# EAGLE design Controller (EAGLE 9.6.2)
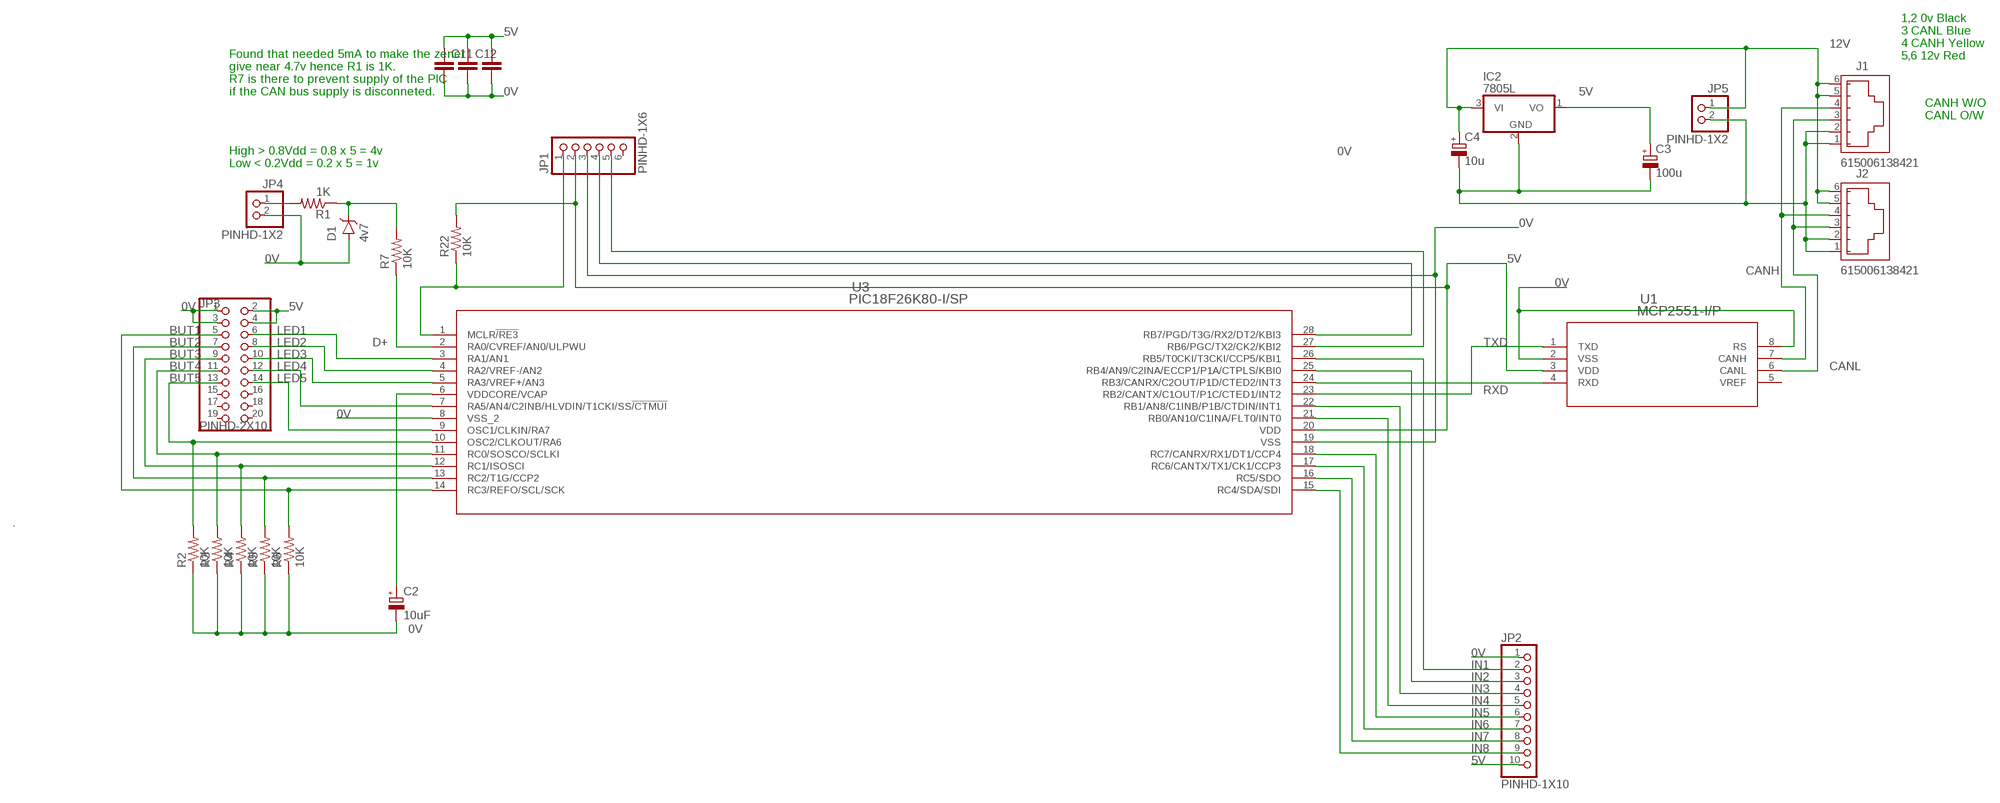
[diagram p0: schematic, sheet 1]

## Parts
C2  10uF  CPOL-EUE3.5-8  [E3,5-8]
C3  100u  CPOL-EUE3.5-8  [E3,5-8]
C4  10u  CPOL-EUE3.5-8  [E3,5-8]
C7  C2,5-3  [C2.5-3]
C11  C2,5-3  [C2.5-3]
C12  C2,5-3  [C2.5-3]
D1  4v7  BZX55B15-TAP  [DO-35]
IC2  7805L  [TO92]
J1  615006138421  [615006138421]
J2  615006138421  [615006138421]
JP1  PINHD-1X6  [1X06]
JP2  PINHD-1X10  [1X10]
JP3  PINHD-2X10  [2X10]
JP4  PINHD-1X2  [1X02]
JP5  PINHD-1X2  [1X02]
R1  1K  RES_7  [0204/7]
R2  10K  RES_7  [0204/7]
R3  10K  RES_7  [0204/7]
R4  10K  RES_7  [0204/7]
R5  10K  RES_7  [0204/7]
R6  10K  RES_7  [0204/7]
R7  10K  RES_7  [0204/7]
R22  10K  RES_7  [0204/7]
U1  MCP2551-I/P  [PDIP8_300MC_MCH]
U3  PIC18F26K80-I/SP  [SPDIP28_300MC_MCH]

## Nets
0V: C2.- C3.- C4.- C7.2 C11.2 C12.2 D1.A IC2.2(GND) J1.1 J1.2 J2.1 J2.2 JP1.3 JP2.1 JP3.1 JP3.3 JP4.2 JP5.2 R2.1 R3.1 R4.1 R5.1 R6.1 U1.2(VSS) U1.8(RS) U3.8(VSS_2) U3.19(VSS)
5V: C3.+ C7.1 C11.1 C12.1 IC2.1(VO) JP1.2 JP2.10 JP3.2 JP3.4 R22.2 U1.3(VDD) U3.20(VDD)
12V: C4.+ IC2.3(VI) J1.5 J1.6 J2.5 J2.6 JP5.1
BUT1: JP3.5 R6.2 U3.14(RC3/REFO/SCL/SCK)
BUT2: JP3.7 R5.2 U3.13(RC2/T1G/CCP2)
BUT3: JP3.9 R4.2 U3.12(RC1/ISOSCI)
BUT4: JP3.11 R3.2 U3.11(RC0/SOSCO/SCLKI)
BUT5: JP3.13 R2.2 U3.10(OSC2/CLKOUT/RA6)
CANH: J1.4 J2.4 U1.7(CANH)
CANL: J1.3 J2.3 U1.6(CANL)
D+: R7.1 U3.2(RA0/CVREF/AN0/ULPWU)
IN1: JP2.2 U3.26(RB5/T0CKI/T3CKI/CCP5/KBI1)
IN2: JP2.3 U3.25(RB4/AN9/C2INA/ECCP1/P1A/CTPLS/KBI0)
IN3: JP2.4 U3.22(RB1/AN8/C1INB/P1B/CTDIN/INT1)
IN4: JP2.5 U3.21(RB0/AN10/C1INA/FLT0/INT0)
IN5: JP2.6 U3.18(RC7/CANRX/RX1/DT1/CCP4)
IN6: JP2.7 U3.17(RC6/CANTX/TX1/CK1/CCP3)
IN7: JP2.8 U3.16(RC5/SDO)
IN8: JP2.9 U3.15(RC4/SDA/SDI)
LED1: JP3.6 U3.3(RA1/AN1)
LED2: JP3.8 U3.4(RA2/VREF-/AN2)
LED3: JP3.10 U3.5(RA3/VREF+/AN3)
LED4: JP3.12 U3.7(RA5/AN4/C2INB/HLVDIN/T1CKI/SS!/CTMUI)
LED5: JP3.14 U3.9(OSC1/CLKIN/RA7)
N$1: D1.C R1.1 R7.2
N$5: JP1.1 R22.1 U3.1(MCLR!/RE3)
N$8: JP1.4 U3.28(RB7/PGD/T3G/RX2/DT2/KBI3)
N$9: JP1.5 U3.27(RB6/PGC/TX2/CK2/KBI2)
N$14: C2.+ U3.6(VDDCORE/VCAP)
N$25: JP4.1 R1.2
RXD: U1.4(RXD) U3.24(RB3/CANRX/C2OUT/P1D/CTED2/INT3)
TXD: U1.1(TXD) U3.23(RB2/CANTX/C1OUT/P1C/CTED1/INT2)
Unconnected: JP1.6 JP3.15 JP3.16 JP3.17 JP3.18 JP3.19 JP3.20 U1.5(VREF)

## Notes on the sheet
- 1,2 0v Black
  3 CANL Blue
  4 CANH Yellow
  5,6 12v Red
- Found that needed 5mA to make the zener
  give near 4.7v hence R1 is 1K.
  R7 is there to prevent supply of the PIC
  if the CAN bus supply is disconneted.
- CANH W/O
  CANL O/W
- High > 0.8Vdd = 0.8 x 5 = 4v
  Low < 0.2Vdd = 0.2 x 5 = 1v

## Library data of the parts
C2-C4 = andrew-boyson:CPOL-EU: POLARIZED CAPACITOR, European symbol; SPICEPREFIX: C
C7 C11 C12 = capacitor-wima:C: CAPACITOR naming: grid - package width
D1 = Diodes-2:BZX55B15-TAP: DIODE ZENER 15V 500MW DO35 Manufacturer's datasheet <https://www.vishay.com/docs/85604/bzx55.pdf>; CREATED_BY: PCBLayout.com; DIGIKEY_PARTNO: BZX55B15-TAPGICT-ND; MANUFACTURER: Vishay General Semiconductor - Diodes Division; MPN: BZX55B15-TAP; PACKAGE: DO-35
IC2 = adafruit:78*: Positive VOLTAGE REGULATOR Added bigger pads to the TO-92 package
J1 J2 = Wurth_Connectors_WR-MJ:615006138421: WR-MJ Modular Jack Horizontal Plastic 6PxC Tab Up KIND PROPERTIES Quality Class:500 Mating cycles General Information Operating Temperature:-40 up to +85 °C Compliance: RoHS Electrical Properties IR 1:1.5A Working Voltage:120V (AC) Withstanding Voltage:1000V (AC) Contact Resistance:20mΩ RISO:500 MΩ Material Properties Insulator MateriaL:PBT Insulator Flammability Rating:UL94 V-0 Color:Black Contact Material Copper Alloy Contact Plating:Gold Contact Type:Stamped Packaging Properties Packaging:Tray <https://www.we-online.com/catalog/media/o33138v209%20Family_WR-MJ_61500x138421.jpg> Details see: https://www.we-online.com/catalog/en/MJ_HORIZONTAL_PLASTIC_6PXC_TAB_UP/? Updated by Yingchun,Shan 2020-01-06 2020 (C) Würth Elektronik; DATASHEET-URL: https://www.we-online.com/catalog/datasheet/615006138421.pdf; MOUNT: THT; PART-NUMBER: 615006138421; TYPE: Horizontal; XPXC: 6P6C
JP1 = Connector:PINHD-1X6: PIN HEADER; CATEGORY: CONNECTOR; SUB-CATEGORY: PIN-HEADER
JP2 = Connector:PINHD-1X10: PIN HEADER; CATEGORY: CONNECTOR; SUB-CATEGORY: PIN-HEADER
JP3 = Connector:PINHD-2X10: PIN HEADER; CATEGORY: CONNECTOR; SUB-CATEGORY: PIN-HEADER
JP4 JP5 = Connector:PINHD-1X2: PIN HEADER; CATEGORY: CONNECTOR; SUB-CATEGORY: PIN-HEADER
R1-R7 R22 = andrew-boyson:RES_7: RESISTOR, American symbol
U1 = andrew-boyson:MCP2551-I/P; COPYRIGHT: Copyright (C) 2021 Ultra Librarian. All rights reserved.; MANUFACTURER_PART_NUMBER: MCP2551-I/P; MFR_NAME: Microchip
U3 = andrew-boyson:PIC18F26K80-I/SP; COPYRIGHT: Copyright (C) 2021 Ultra Librarian. All rights reserved.; MANUFACTURER_PART_NUMBER: pic18f26k80-i/sp; MFR_NAME: Microchip

## Board
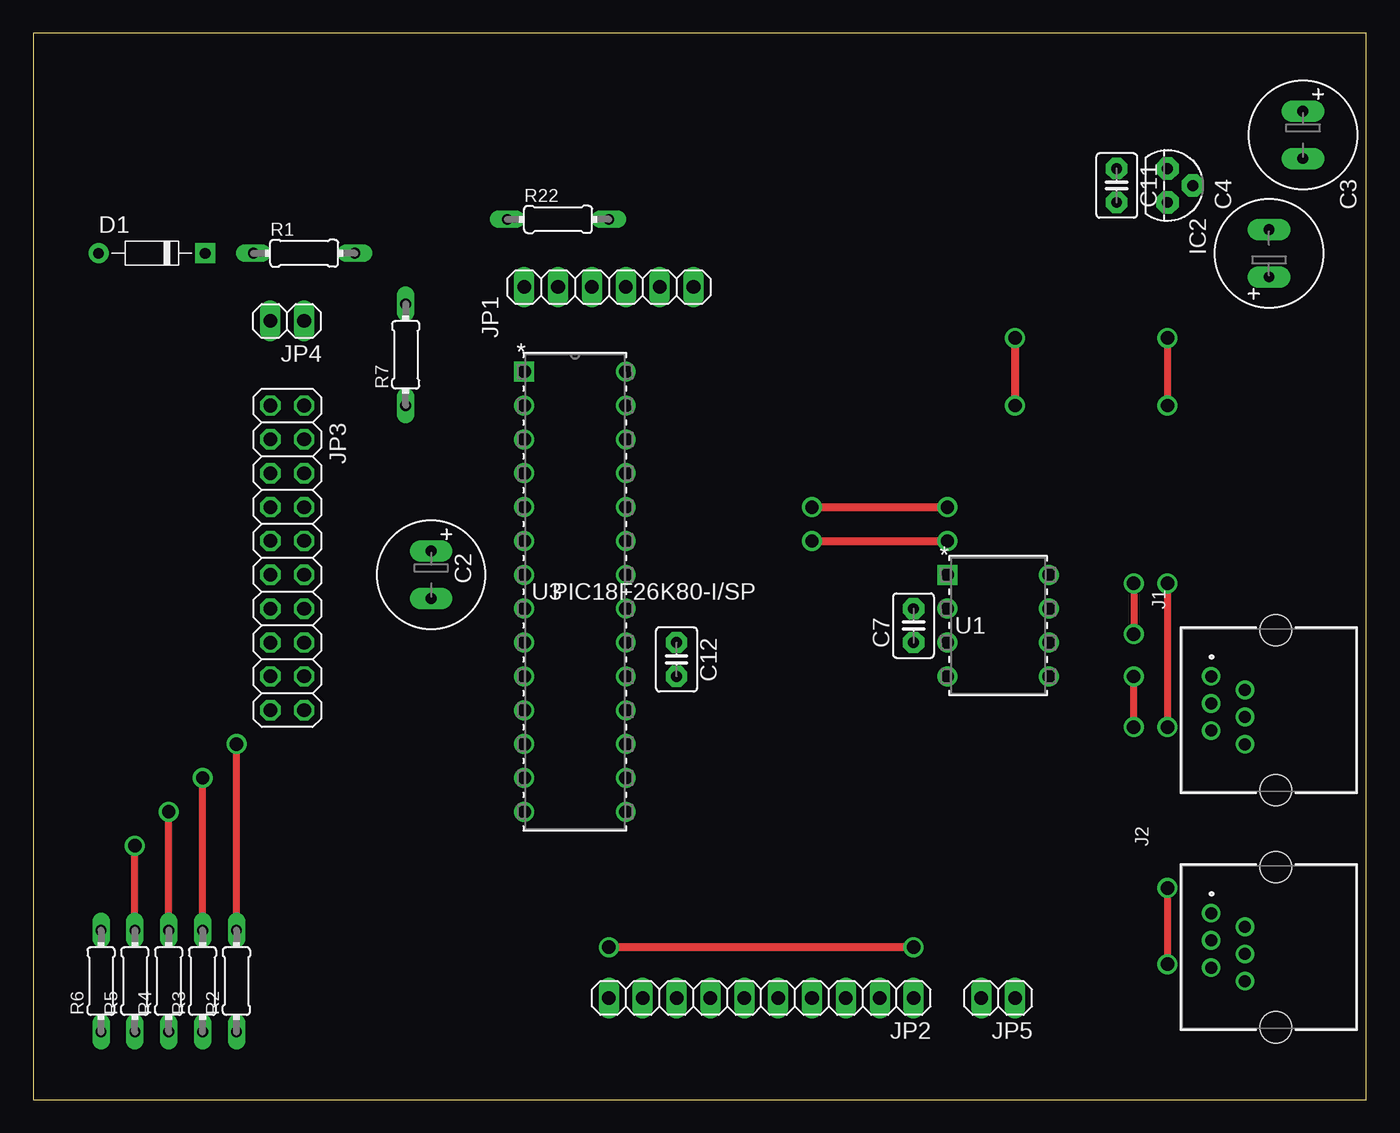
[diagram p1: board, top side]
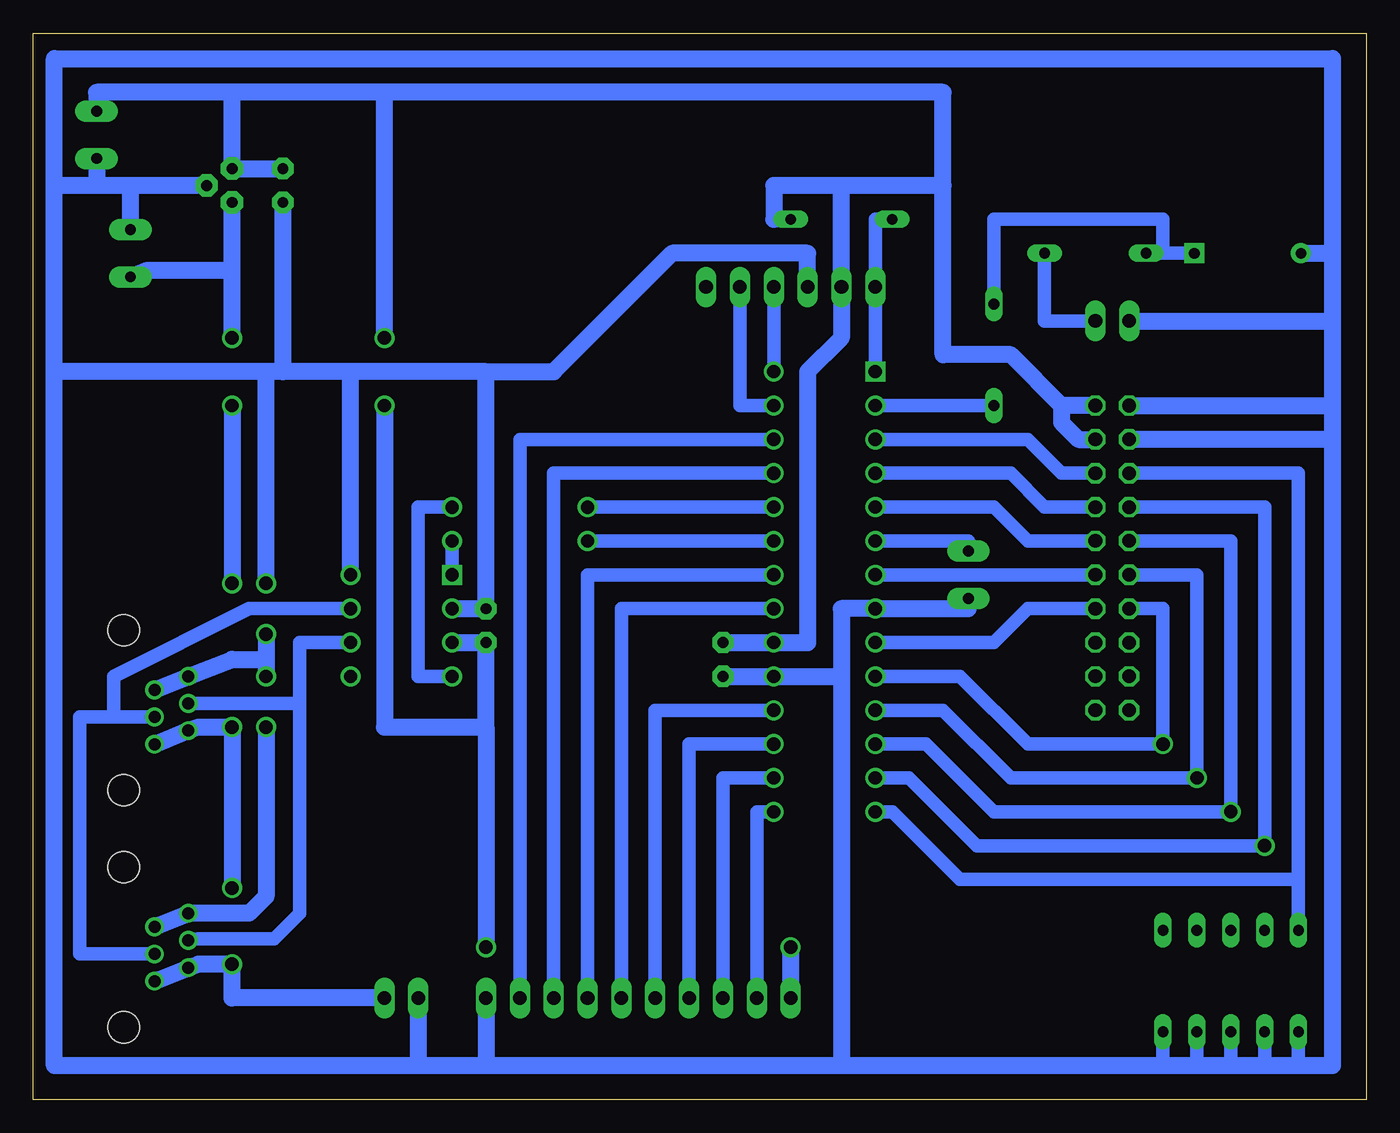
[diagram p2: board, bottom side, seen from below]

Size 100 x 80 mm. Coordinates in mm from the lower left corner, seen from the top.
Outline: 0,0 100,0 100,80 0,80 0,0
Copper layers (1*16): Top 0.035mm / dielectric 1.5mm / Bottom 0.035mm
Design rules "default": minimum track width 6mil, minimum drill 0.35mm, track to track 6mil, track to pad 6mil, pad to pad 6mil, via to via 6mil, smd to smd 6mil, copper to edge 40mil, drill to drill 6mil, minimum pad ring 10mil, minimum via ring 8mil, stop-mask expansion 4mil, vias tented up to drill 0mil, thermal gap 10mil

### Footprints (pad centres in the part's own frame; a part is rotated, then mirrored left to right if it is on the bottom)
E3,5-8 = drill 0.813 pad 1.6 long: + -1.778,0; - 1.778,0
C2.5-3 = drill 0.813 pad 1.6 octagon: 1 -1.27,0; 2 1.27,0
DO-35 = drill 0.8 pad 1.5: A -4,0 | drill 0.8 pad 1.5 square: C 4,0
TO92 = drill 0.813 pad 1.676 octagon: 1 -1.27,0; 2 0,1.905; 3 1.27,0
615006138421 = drill 0.9: 1 2.55,4.34; 2 1.53,1.8; 3 0.51,4.34; 4 -0.51,1.8; 5 -1.53,4.34; 6 -2.55,1.8 | hole 2.36: -6,-0.5; 6,-0.5
1X06 = drill 1.016 long: 1 -6.35,0; 2 -3.81,0; 3 -1.27,0; 4 1.27,0; 5 3.81,0; 6 6.35,0
1X10 = drill 1.016 long: 1 -11.43,0; 2 -8.89,0; 3 -6.35,0; 4 -3.81,0; 5 -1.27,0; 6 1.27,0; 7 3.81,0; 8 6.35,0; 9 8.89,0; 10 11.43,0
2X10 = drill 1.016 octagon: 1 -11.43,-1.27; 2 -11.43,1.27; 3 -8.89,-1.27; 4 -8.89,1.27; 5 -6.35,-1.27; 6 -6.35,1.27; 7 -3.81,-1.27; 8 -3.81,1.27; 9 -1.27,-1.27; 10 -1.27,1.27; 11 1.27,-1.27; 12 1.27,1.27; 13 3.81,-1.27; 14 3.81,1.27; 15 6.35,-1.27; 16 6.35,1.27; 17 8.89,-1.27; 18 8.89,1.27; 19 11.43,-1.27; 20 11.43,1.27
1X02 = drill 1.016 long: 1 -1.27,0; 2 1.27,0
0204/7 = drill 0.813 long: 1 -3.81,0; 2 3.81,0
PDIP8_300MC_MCH = drill 0.991 pad 1.499 square: 1 0,0 | drill 0.991 pad 1.499: 2 0,-2.54; 3 0,-5.08; 4 0,-7.62; 5 7.62,-7.62; 6 7.62,-5.08; 7 7.62,-2.54; 8 7.62,0
SPDIP28_300MC_MCH = drill 0.991 pad 1.499 square: 1 0,0 | drill 0.991 pad 1.499: 2 0,-2.54; 3 0,-5.08; 4 0,-7.62; 5 0,-10.16; 6 0,-12.7; 7 0,-15.24; 8 0,-17.78; 9 0,-20.32; 10 0,-22.86; 11 0,-25.4; 12 0,-27.94; 13 0,-30.48; 14 0,-33.02; 15 7.62,-33.02; 16 7.62,-30.48; 17 7.62,-27.94; 18 7.62,-25.4; 19 7.62,-22.86; 20 7.62,-20.32; 21 7.62,-17.78; 22 7.62,-15.24; 23 7.62,-12.7; 24 7.62,-10.16; 25 7.62,-7.62; 26 7.62,-5.08; 27 7.62,-2.54; 28 7.62,0

### Placement (x,y rotation side)
C2  29.84,39.37 270 top
C3  95.25,72.39 270 top
C4  92.71,63.5 90 top
C7  66.04,35.56 90 top
C11  81.28,68.58 270 top
C12  48.26,33.02 270 top
D1  8.89,63.5 0 top
IC2  85.09,68.58 270 top
J1  92.71,29.21 90 top
J2  92.71,11.43 90 top
JP1  43.18,60.96 0 top
JP2  54.61,7.62 180 top
JP3  19.05,40.64 270 top
JP4  19.05,58.42 180 top
JP5  72.39,7.62 180 top
R1  20.32,63.5 0 top
R2  15.24,8.89 90 top
R3  12.7,8.89 90 top
R4  10.16,8.89 90 top
R5  7.62,8.89 90 top
R6  5.08,8.89 90 top
R7  27.94,55.88 90 top
R22  39.37,66.04 0 top
U1  68.58,39.37 0 top
U3  36.83,54.61 0 top

### Tracks (layer width: path | path; a pad name or v marks a point on that pad's centre or on a via)
0V  (via drill 1)
  Top 0.508: v82.55,27.94 v82.55,31.75 | v82.55,38.73 v82.55,34.92
  Bottom 1.016: 71.12,2.61 70.91,2.54 | R6.1 5.08,2.54 | R2.1 15.24,2.54 | R3.1 12.7,2.54 | R4.1 10.16,2.54 | R5.1 7.62,2.54
  Bottom 1.27: 39.37,31.75 U3.19 C12.2 | JP1.3 41.91,63.5 52.07,63.5 60.96,54.61 66.04,54.61 | U1.2 C7.2 66.04,54.61 | 39.37,31.75 39.37,2.54 | C2.- 29.84,36.83 U3.8 39.37,36.83 39.37,31.75 | 39.37,2.54 66.04,2.54 | 66.04,2.54 70.91,2.54 98.42,2.54 98.42,54.61 | J1.2 J1.1 85.09,33.02 82.55,33.02 | J2.2 J2.1 83.82,13.97 82.55,15.24 v82.55,27.94 | 66.04,54.61 76.2,54.61 | 76.2,54.61 81.28,54.61 | 82.55,54.61 98.42,54.61 | 98.42,54.61 98.42,68.58 | IC2.2 92.71,68.58 | 92.71,68.58 95.25,68.58 | 95.25,68.58 98.42,68.58 | C11.2 81.28,54.61 | 81.28,54.61 82.55,54.61 | v82.55,38.73 82.55,54.61 | v82.55,34.92 82.55,33.02 | 82.55,33.02 v82.55,31.75 | C3.- 95.25,68.58 | C4.- 92.71,68.58 | JP3.1 2.54,52.07 | 2.54,52.07 2.54,49.53 | 2.54,49.53 2.54,2.54 5.08,2.54 7.62,2.54 10.16,2.54 12.7,2.54 15.24,2.54 39.37,2.54 | U1.8 76.2,54.61 | JP4.2 2.54,58.42 | 2.54,58.42 2.54,52.07 | D1.A 2.54,63.5 | 2.54,63.5 2.54,58.42 | JP5.2 71.12,2.61 | 98.42,68.58 98.42,78.11 2.54,78.11 2.54,63.5 | 2.54,49.53 JP3.3 | JP2.1 66.04,2.54
5V  (via drill 1)
  Top 0.61: v73.66,57.15 v73.66,52.07 | v66.04,11.43 v43.18,11.43
  Bottom 1.27: U1.3 C7.1 66.04,27.94 | C12.1 U3.20 41.91,34.29 41.91,54.61 39.37,57.15 JP1.2 39.37,68.58 | 31.75,68.58 39.37,68.58 | 39.37,68.58 44.45,68.58 44.45,66.04 R22.2 | 31.75,68.58 31.75,75.56 73.66,75.56 | 73.66,75.56 85.09,75.56 | 85.09,75.56 95.25,75.56 C3.+ | 85.09,75.56 IC2.1 C11.1 | JP3.2 22.86,52.07 | 22.86,52.07 26.67,55.88 31.75,55.88 31.75,68.58 | v73.66,57.15 73.66,75.56 | 66.04,27.94 v66.04,11.43 | 66.04,27.94 73.66,27.94 v73.66,52.07 | 22.86,52.07 22.86,50.8 21.59,49.53 JP3.4 | v43.18,11.43 JP2.10
12V  (via drill 1)
  Top 0.508: v85.09,57.15 v85.09,52.07 | v85.09,38.73 v85.09,27.94 | v85.09,15.88 v85.09,10.16
  Bottom 1.27: J2.6 J2.5 87.63,10.16 v85.09,10.16 85.09,7.62 JP5.1 | J1.6 J1.5 87.63,27.94 v85.09,27.94 v85.09,15.88 | v85.09,57.15 85.09,62.23 | 85.09,62.23 IC2.3 | C4.+ 91.44,62.23 85.09,62.23 | v85.09,52.07 v85.09,38.73
BUT1
  Bottom 1.016: U3.14 35.56,21.59 30.48,16.51 5.08,16.51 | 5.08,16.51 5.08,46.99 JP3.5 | R6.2 5.08,16.51
BUT2  (via drill 1)
  Top 0.508: R5.2 v7.62,19.05
  Bottom 1.016: U3.13 34.29,24.13 29.21,19.05 v7.62,19.05 7.62,44.45 JP3.7
BUT3  (via drill 1)
  Top 0.508: R4.2 v10.16,21.59
  Bottom 1.016: U3.12 33.02,26.67 27.94,21.59 v10.16,21.59 10.16,41.91 JP3.9
BUT4  (via drill 1)
  Top 0.508: R3.2 v12.7,24.13
  Bottom 1.016: U3.11 31.75,29.21 26.67,24.13 v12.7,24.13 12.7,39.37 JP3.11
BUT5  (via drill 1)
  Top 0.508: R2.2 v15.24,26.67
  Bottom 1.016: U3.10 30.48,31.75 25.4,26.67 v15.24,26.67 15.24,36.83 JP3.13
CANH
  Bottom 1.016: J1.4 92.71,28.7 93.98,28.7 | J2.4 92.71,10.92 96.52,10.92 96.52,28.7 93.98,28.7 | 93.98,28.7 93.98,31.75 83.82,36.83 U1.7
CANL
  Bottom 1.016: U1.6 80.01,34.29 80.01,29.72 | 80.01,29.72 80.01,13.97 81.92,12.06 87.63,12.06 J2.3 | J1.3 80.01,29.72
D+
  Bottom 1.016: U3.2 R7.1
IN1
  Bottom 1.016: JP2.2 63.5,49.53 U3.26
IN2
  Bottom 1.016: JP2.3 60.96,46.99 U3.25
IN3
  Bottom 1.016: JP2.4 58.42,39.37 U3.22
IN4
  Bottom 1.016: JP2.5 55.88,36.83 U3.21
IN5
  Bottom 1.016: JP2.6 53.34,29.21 U3.18
IN6
  Bottom 1.016: JP2.7 50.8,26.67 U3.17
IN7
  Bottom 1.016: JP2.8 48.26,24.13 U3.16
IN8
  Bottom 1.016: JP2.9 45.72,21.59 U3.15
LED1
  Bottom 1.016: JP3.6 22.86,46.99 25.4,49.53 U3.3
LED2
  Bottom 1.016: JP3.8 24.13,44.45 26.67,46.99 U3.4
LED3
  Bottom 1.016: JP3.10 25.4,41.91 27.94,44.45 U3.5
LED4
  Bottom 1.016: JP3.12 U3.7
LED5
  Bottom 1.016: U3.9 27.94,34.29 25.4,36.83 JP3.14
N$1
  Bottom 1.016: 15.24,63.5 15.24,66.04 27.94,66.04 R7.2 | 15.24,63.5 D1.C | R1.1 15.24,63.5
N$5
  Bottom 1.016: R22.1 36.83,66.04 JP1.1 U3.1
N$8
  Bottom 1.016: JP1.4 U3.28
N$9
  Bottom 1.016: JP1.5 46.99,52.07 U3.27
N$14
  Bottom 1.016: U3.6 29.84,41.91 C2.+
N$25
  Bottom 1.016: R1.2 24.13,58.42 JP4.1
RXD  (via drill 1)
  Top 0.61: v58.42,44.45 v68.58,44.45
  Bottom 1.016: U1.4 71.12,31.75 71.12,44.45 v68.58,44.45 | U3.24 v58.42,44.45
TXD  (via drill 1)
  Top 0.61: v58.42,41.91 v68.58,41.91
  Bottom 1.016: v68.58,41.91 U1.1 | U3.23 v58.42,41.91